# Altium schematic sheet Main.SchDoc: =DocumentName
size A4; SheetNumber: 1; SheetTotal: 7
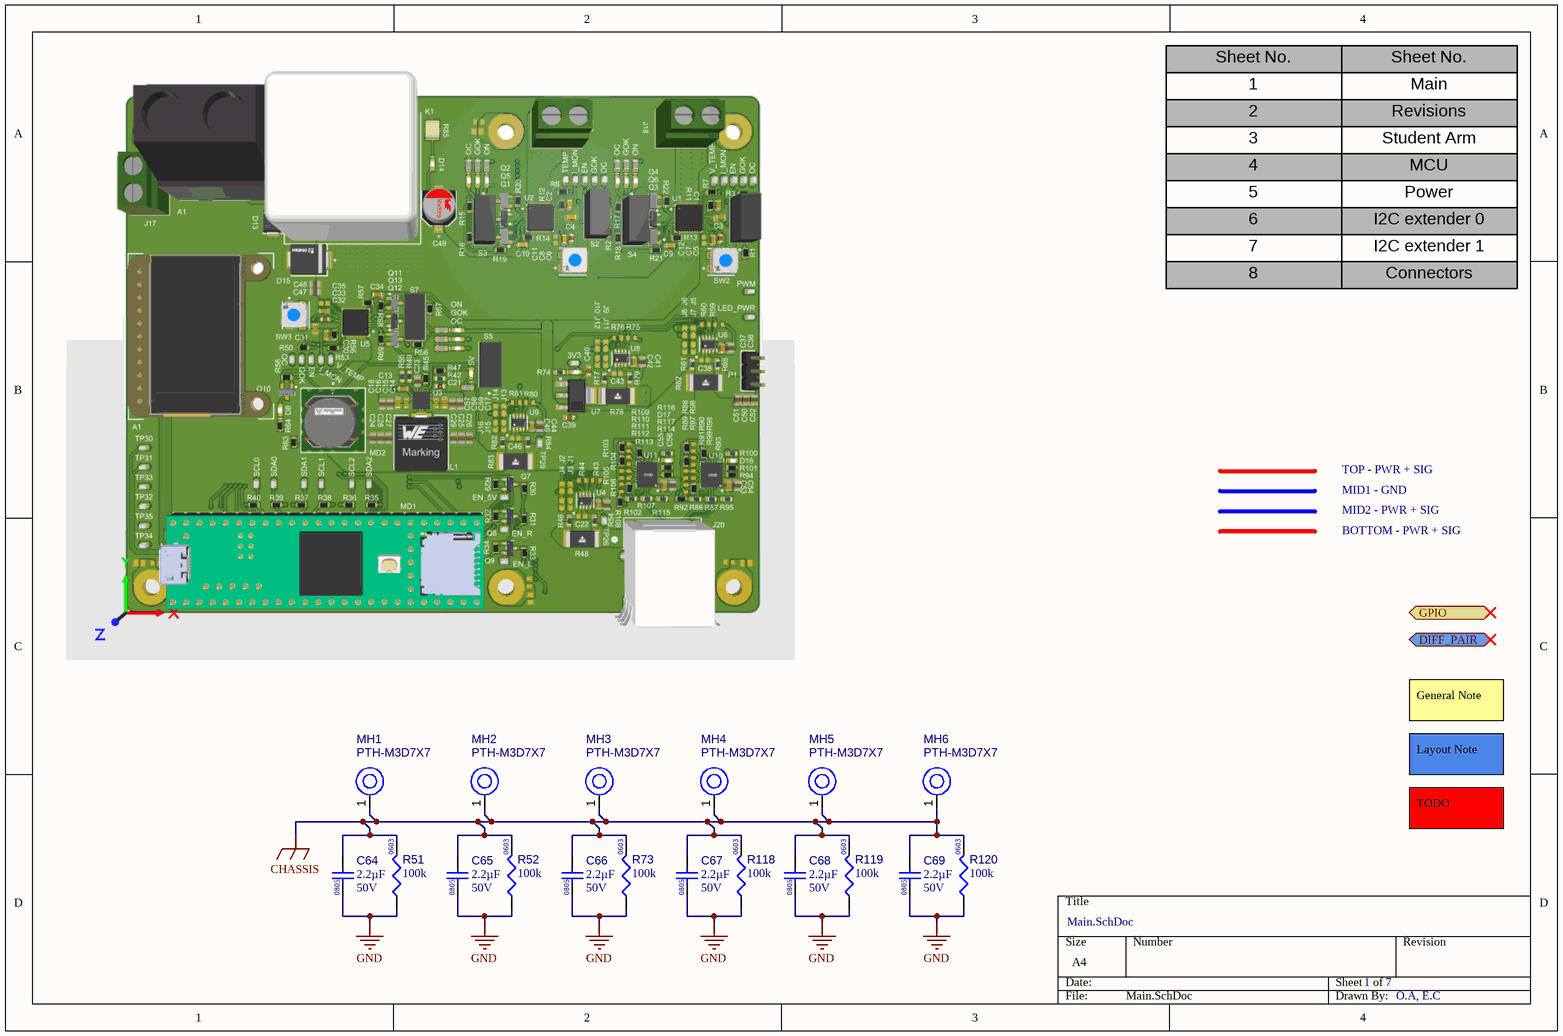
[diagram p0: Main.SchDoc]

## Parts
C64  value 2.2µF  Rated DC Voltage (URdc): 50V  Case/Package: 0805  [FP-CL21-IPC_C]  (hidden comment: CL21A225KBFNNNE)
C65  value 2.2µF  Rated DC Voltage (URdc): 50V  Case/Package: 0805  [FP-CL21-IPC_C]  (hidden comment: CL21A225KBFNNNE)
C66  value 2.2µF  Rated DC Voltage (URdc): 50V  Case/Package: 0805  [FP-CL21-IPC_C]  (hidden comment: CL21A225KBFNNNE)
C67  value 2.2µF  Rated DC Voltage (URdc): 50V  Case/Package: 0805  [FP-CL21-IPC_C]  (hidden comment: CL21A225KBFNNNE)
C68  value 2.2µF  Rated DC Voltage (URdc): 50V  Case/Package: 0805  [FP-CL21-IPC_C]  (hidden comment: CL21A225KBFNNNE)
C69  value 2.2µF  Rated DC Voltage (URdc): 50V  Case/Package: 0805  [FP-CL21-IPC_C]  (hidden comment: CL21A225KBFNNNE)
MH1  PTH-M3D7X7  [PTH-M2D5X5]
MH2  PTH-M3D7X7  [PTH-M2D5X5]
MH3  PTH-M3D7X7  [PTH-M2D5X5]
MH4  PTH-M3D7X7  [PTH-M2D5X5]
MH5  PTH-M3D7X7  [PTH-M2D5X5]
MH6  PTH-M3D7X7  [PTH-M2D5X5]
R51  value 100k  Case/Package: 0603  [RESC1608X55X25NL10T15]  (hidden comment: RC0603FR-07100KL)
R52  value 100k  Case/Package: 0603  [RESC1608X55X25NL10T15]  (hidden comment: RC0603FR-07100KL)
R73  value 100k  Case/Package: 0603  [RESC1608X55X25NL10T15]  (hidden comment: RC0603FR-07100KL)
R118  value 100k  Case/Package: 0603  [RESC1608X55X25NL10T15]  (hidden comment: RC0603FR-07100KL)
R119  value 100k  Case/Package: 0603  [RESC1608X55X25NL10T15]  (hidden comment: RC0603FR-07100KL)
R120  value 100k  Case/Package: 0603  [RESC1608X55X25NL10T15]  (hidden comment: RC0603FR-07100KL)

## Ports
DIFF_PAIR (bidir), GPIO (bidir)

## Nets
CHASSIS: C64.2 C65.2 C66.2 C67.2 C68.2 C69.2 MH1.1(H1) MH2.1(H1) MH3.1(H1) MH4.1(H1) MH5.1(H1) MH6.1(H1) R51.2 R52.2 R73.2 R118.2 R119.2 R120.2
GND: C64.1 C65.1 C66.1 C67.1 C68.1 C69.1 R51.1 R52.1 R73.1 R118.1 R119.1 R120.1

## Notes on the sheet
- Sheet No.
- 1
- Main
- 2
- 3
- 4
- Revisions
- Student Arm
- MCU
- 5
- 6
- Power
- I2C extender 0
- 7
- 8
- I2C extender 1
- Connectors
- TOP - PWR + SIG
- MID1 - GND
- MID2 - PWR + SIG
- BOTTOM - PWR + SIG
- General Note
- Layout Note
- TODO
- O.A, E.C

## Library data of the parts
C64-C69 = CMP-001-00099-1: Ceramic Capacitor, Multilayer, Ceramic, 50V, 10% +Tol, 10% -Tol, X5R, 15% TC, 2.2uF, Surface Mount, 0805; Multilayer: Yes; Dielectric Material: Ceramic; Length: 2mm; Pins: 2; Tolerance  (fill in as +-): 10%; RoHS Compliant: Yes; Package Style: SMTMeter; Reach SVHC Compliant: Yes; Min Operating Temperature: -55°C; Temperature Characteristics Code: X5R; Tolerance (fill in as +-): 10%; Capacitor Type: Ceramic; Width: 1.25mm; Terminal Finish: Nickel; Termination: Wraparound; Package Shape: Rectangular; Packaging: Tape and Reel; Mounting Technology: Surface Mount; JESD-609 Code: e3; Height: 1.25mm; Max Operating Temperature: 85°C
MH1-MH6 = CMP-00028-00009-3: M3 PTH (3.3mm), 7mm pad; Pins: 1
R51 R52 R73 R118-R120 = CMP-009-00195-1: Fixed Resistor, Metal Glaze/thick Film, 0.1W, 100000ohm, 75V, 1% +/-Tol, 100ppm/Cel, Surface Mount, 0603; Power: 100mW; Voltage Rating: 50V; Package Length: 1.6mm; Package Height: 0.45mm; Rated Temperature: 70°C; Package Width: 0.8mm; Temperature Coefficient: 100ppm/°C; Additional Feature: LASER TRIMMABLE; Pins: 2; Reach SVHC Compliant: Yes; Terminal Finish: Nickel; RoHS Compliant: Yes; Technology: METAL GLAZE/THICK FILM; JESD-609 Code: e3; Working Voltage: 75V; Construction: Chip; Mounting Technology: Surface Mount; Package Style: SMTMeter; Packaging: Tape and Reel; Min Operating Temperature: -55°C; Termination: Wraparound; Tolerance: 1%; Package Shape: Rectangular; Max Operating Temperature: 155°C; Resistor Type: FIXED RESISTOR